# Altium schematic sheet 03 BATTERY MANAGEMENT.SchDoc
size 420 x 297 mm
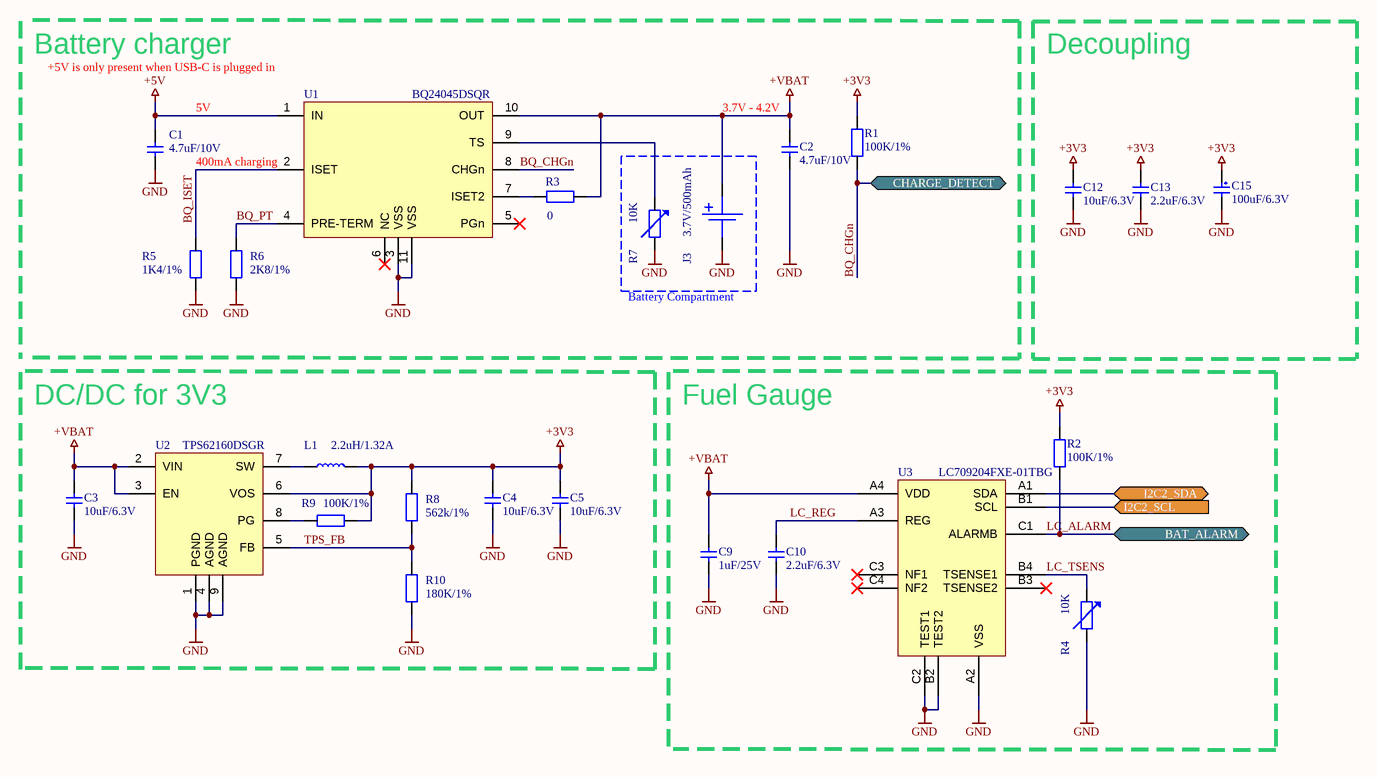
[diagram p0: 03 BATTERY MANAGEMENT.SchDoc]

## Parts
C1  4.7uF/10V  [CAPC1005X06N]
C2  4.7uF/10V  [CAPC1005X06N]
C3  10uF/6.3V  [CAPC1005X06N]
C4  10uF/6.3V  [CAPC1005X06N]
C5  10uF/6.3V  [CAPC1005X06N]
C9  1uF/25V  [CAPC1005X06N]
C10  2.2uF/6.3V  [CAPC1005X06N]
C12  10uF/6.3V  [CAPC1005X06N]
C13  2.2uF/6.3V  [CAPC1005X06N]
C15  100uF/6.3V  [CAPMP3528X21N]
J3  3.7V/500mAh  [BATTERY_SMD_CONN]
L1  2.2uH/1.32A  [INDP4040X12N]
R1  100K/1%  [RESC1005X04N]
R2  100K/1%  [RESC1005X04N]
R3  0  [RESC1005X04N]
R4  10K  [RESC1005X04N]
R5  1K4/1%  [RESC1005X04N]
R6  2K8/1%  [RESC1005X04N]
R7  10K  [RESC1005X04N]
R8  562k/1%  [RESC1005X04N]
R9  100K/1%  [RESC1005X04N]
R10  180K/1%  [RESC1005X04N]
U1  BQ24045DSQR  [SON40P200X80_HS-11N]
U2  TPS62160DSGR  [SON50P200X80_HS-9N]
U3  LC709204FXE-01TBG  [BGA12C40P4X3_191X148X51]

## Blocks framed on the sheet
Decoupling: C12 C13 C15

## Ports
BAT_ALARM (bidir), CHARGE_DETECT (bidir), I2C2_SCL (in), I2C2_SDA (bidir)

## Nets
+3V3: C4.2 C5.2 C12.2 C13.2 C15.1 L1.2 R1.1 R2.1 R8.2 R9.1 U2.6(VOS)
+5V: C1.2 U1.1(IN)
+VBAT: C2.2 C3.2 C9.2 J3.1(+) R3.2 U1.10(OUT) U2.2(VIN) U2.3(EN) U3.A4(VDD)
GND: C1.1 C2.1 C3.1 C4.1 C5.1 C9.1 C10.1 C12.1 C13.1 C15.2 J3.2(-) R4.1 R5.1 R6.1 R7.1 R10.1 U1.3(VSS) U1.11(VSS) U2.1(PGND) U2.4(AGND) U2.9(AGND) U3.A2(VSS) U3.B2(TEST2) U3.C2(TEST1)
BQ_CHGn: R1.2 U1.8(CHGn) ; port CHARGE_DETECT
BQ_ISET: R5.2 U1.2(ISET)
BQ_PT: R6.2 U1.4(PRE-TERM)
I2C2_SCL: U3.B1(SCL) ; port I2C2_SCL
I2C2_SDA: U3.A1(SDA) ; port I2C2_SDA
LC_ALARM: R2.2 U3.C1(ALARMB) ; port BAT_ALARM
LC_REG: C10.2 U3.A3(REG)
LC_TSENS: R4.2 U3.B4(TSENSE1)
TPS_FB: R8.1 R10.2 U2.5(FB)
NetL1_1: L1.1 U2.7(SW)
NetR3_1: R3.1 U1.7(ISET2)
NetR7_2: R7.2 U1.9(TS)
NetR9_2: R9.2 U2.8(PG)

Not connected (* = marked no-connect by the designer): U1 5(PGn)* 6(NC)*; U3 B3(TSENSE2)* C3(NF1)* C4(NF2)*

## Notes on the sheet
- Battery charger
- (near U1) +5V is only present when USB-C is plugged in
- (near C1) 5V
- (near C2) 3.7V - 4.2V
- (near U1) 400mA charging
- Battery Compartment
- DC/DC for 3V3
- Fuel Gauge
- Title
- Project
- Size
- Date
- Revision
- A3

## Library data of the parts
C1 C2 = CL05A475MP5NRNC: 10V 4.7uF X5R ±20% 0402  Multilayer Ceramic Capacitors MLCC - SMD/SMT ROHS; manufacturer: Samsung Electro-Mechanics; assembler_number: C23733; mfr_part_number: CL05A475MP5NRNC; datasheet: https://datasheet.lcsc.com/lcsc/1810191211_Samsung-Electro-Mechanics-CL05A475MP5NRNC_C23733.pdf
C3-C5 C12 = CL05A106MQ5NUNC: 6.3V 10uF X5R ±20% 0402  Multilayer Ceramic Capacitors MLCC - SMD/SMT ROHS; manufacturer: Samsung Electro-Mechanics; assembler_number: C15525; mfr_part_number: CL05A106MQ5NUNC; datasheet: https://datasheet.lcsc.com/lcsc/2208231630_Samsung-Electro-Mechanics-CL05A106MQ5NUNC_C15525.pdf
C9 = CL05A105KA5NQNC: 25V 1uF X5R ±10% 0402  Multilayer Ceramic Capacitors MLCC - SMD/SMT ROHS; manufacturer: Samsung Electro-Mechanics; assembler_number: C52923; mfr_part_number: CL05A105KA5NQNC; datasheet: https://datasheet.lcsc.com/lcsc/1811091611_Samsung-Electro-Mechanics-CL05A105KA5NQNC_C52923.pdf
C10 C13 = CL05A225MQ5NSNC: 6.3V 2.2uF X5R ±20% 0402  Multilayer Ceramic Capacitors MLCC - SMD/SMT ROHS; manufacturer: Samsung Electro-Mechanics; assembler_number: C12530; mfr_part_number: CL05A225MQ5NSNC; datasheet: https://datasheet.lcsc.com/lcsc/1811021410_Samsung-Electro-Mechanics-CL05A225MQ5NSNC_C12530.pdf
C15 = TAJB107K006RNJ: 100uF 6.3V -55℃~+125℃ 1.7Ω@100kHz ±10% CASE-B_3528 Tantalum Capacitors ROHS; manufacturer: Kyocera AVX; assembler_number: C16133; mfr_part_number: TAJB107K006RNJ; datasheet: https://datasheet.lcsc.com/lcsc/2111161030_Kyocera-AVX-TAJB107K006RNJ-_C16133.pdf
J3 = SMD_Connector_2Pole
L1 = FNR4012S2R2MT: 1.32A 2.2uH ±20% 104mΩ SMD  Power Inductors ROHS; manufacturer: cjiang(Changjiang Microelectronics Tech); assembler_number: C167776; mfr_part_number: FNR4012S2R2MT; datasheet: https://datasheet.lcsc.com/lcsc/1806060533_cjiang-Changjiang-Microelectronics-Tech-FNR4012S2R2MT_C167776.pdf
R1 R2 R9 = 0402WGF1003TCE: 62.5mW Thick Film Resistors 50V ±100ppm/℃ ±1% -55℃~+155℃ 100kΩ 0402  Chip Resistor - Surface Mount ROHS; manufacturer: UNI-ROYAL(Uniroyal Elec); assembler_number: C25741; mfr_part_number: 0402WGF1003TCE; datasheet: https://datasheet.lcsc.com/lcsc/2206010100_UNI-ROYAL-Uniroyal-Elec-0402WGF1003TCE_C25741.pdf
R3 = 0402WGF0000TCE: 62.5mW Thick Film Resistors 50V ±800ppm/℃ ±1% -55℃~+155℃ 0Ω 0402  Chip Resistor - Surface Mount ROHS; manufacturer: UNI-ROYAL(Uniroyal Elec); assembler_number: C17168; mfr_part_number: 0402WGF0000TCE; datasheet: https://datasheet.lcsc.com/lcsc/2206010216_UNI-ROYAL-Uniroyal-Elec-0402WGF0000TCE_C17168.pdf
R4 R7 = SDNT1608X103F3950FTF: 10kΩ -55℃~+125℃ 0.33mA 100mW ±1% 3950K ±1% 0603  NTC Thermistors ROHS; manufacturer: Sunlord; assembler_number: C279936; mfr_part_number: SDNT1608X103F3950FTF; datasheet: https://datasheet.lcsc.com/lcsc/2110081430_Sunlord-SDNT1608X103F3950FTF_C279936.pdf
R5 = 0402WGF1401TCE: 62.5mW Thick Film Resistors 50V ±100ppm/℃ ±1% -55℃~+155℃ 1.4kΩ 0402  Chip Resistor - Surface Mount ROHS; manufacturer: UNI-ROYAL(Uniroyal Elec); assembler_number: C39650; mfr_part_number: 0402WGF1401TCE; datasheet: https://datasheet.lcsc.com/lcsc/2206010000_UNI-ROYAL-Uniroyal-Elec-0402WGF1401TCE_C39650.pdf
R6 = WR04X2801FTL: 62.5mW 50V ±100ppm/℃ ±1% -55℃~+155℃ 2.8kΩ 0402  Chip Resistor - Surface Mount ROHS; manufacturer: Walsin Tech Corp; assembler_number: C172044; mfr_part_number: WR04X2801FTL; datasheet: https://datasheet.lcsc.com/lcsc/1810191632_Walsin-Tech-Corp-WR04X2801FTL_C172044.pdf
R8 = 0402WGF5623TCE: 62.5mW Thick Film Resistors 50V ±100ppm/℃ ±1% -55℃~+155℃ 562kΩ 0402  Chip Resistor - Surface Mount ROHS; manufacturer: UNI-ROYAL(Uniroyal Elec); assembler_number: C48838; mfr_part_number: 0402WGF5623TCE; datasheet: https://datasheet.lcsc.com/lcsc/2206010000_UNI-ROYAL-Uniroyal-Elec-0402WGF5623TCE_C48838.pdf
R10 = 0402WGF1803TCE: 62.5mW Thick Film Resistors 50V ±100ppm/℃ ±1% -55℃~+155℃ 180kΩ 0402  Chip Resistor - Surface Mount ROHS; manufacturer: UNI-ROYAL(Uniroyal Elec); assembler_number: C25760; mfr_part_number: 0402WGF1803TCE; datasheet: https://datasheet.lcsc.com/lcsc/2206010100_UNI-ROYAL-Uniroyal-Elec-0402WGF1803TCE_C25760.pdf
U1 = BQ24045DSQR: WSON-10  Battery Management ICs ROHS; manufacturer: Texas Instruments; assembler_number: C148983; mfr_part_number: BQ24045DSQR; datasheet: https://www.ti.com/lit/ds/symlink/bq24045.pdf?HQS=dis-dk-null-digikeymode-dsf-pf-null-wwe&ts=1671793040477&ref_url=https%253A%252F%252Fwww.ti.com%252Fgeneral%252Fdocs%252Fsuppproductinfo.tsp%253FdistId%253D10%2526gotoUrl%253Dhttps%253A%252F%252Fwww.ti.com%252Flit%252Fgpn%252Fbq24045
U2 = TPS62160DSGR: Step-down type WSON-8  DC-DC Converters ROHS; manufacturer: Texas Instruments; assembler_number: C324077; mfr_part_number: TPS62160DSGR; datasheet: https://www.ti.com/cn/lit/gpn/tps62160
U3 = LC709204FXE-01TBG: WLCSP12(1.48x1.91x0.51)  Battery Management ICs ROHS; manufacturer: onsemi; assembler_number: C895466; mfr_part_number: LC709204FXE-01TBG; datasheet: https://datasheet.lcsc.com/lcsc/2108140630_onsemi-LC709204FXE-01TBG_C895466.pdf